# Altium schematic sheet Master.SchDoc
size A4; Author: Jeremiah Lilland; CompanyName: Pinebox Effects; DrawnBy: Jeremiah Lilland; Revision: 1.0
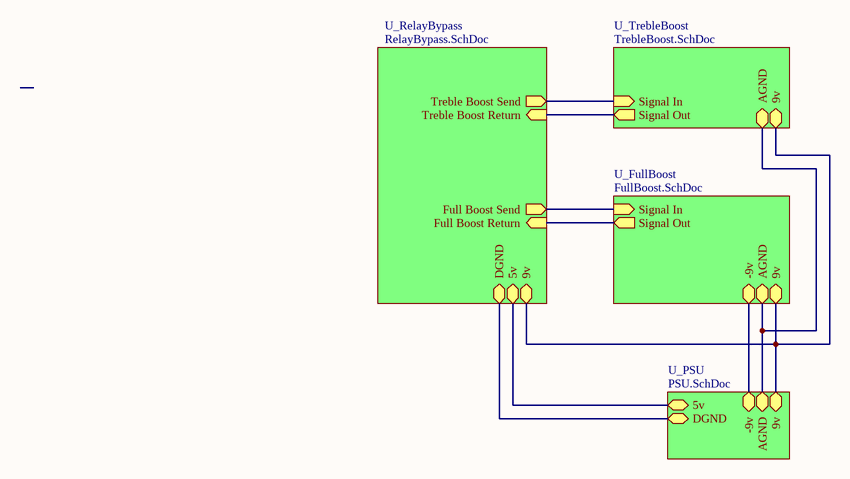
[diagram p0: Master.SchDoc]

## Sub-sheets
U_FullBoost = FullBoost.SchDoc: 9v (bidir), AGND (bidir), -9v (bidir), Signal In (in), Signal Out (out)
U_PSU = PSU.SchDoc: -9v (bidir), DGND (bidir), 5v, AGND, 9v (bidir)
U_RelayBypass = RelayBypass.SchDoc: Treble Boost Send (out), Treble Boost Return (in), Full Boost Send (out), Full Boost Return (in), DGND, 5v, 9v (bidir)
U_TrebleBoost = TrebleBoost.SchDoc: 9v (bidir), AGND (bidir), Signal In (in), Signal Out (out)

## Nets
(unnamed): sheet U_TrebleBoost/9v, sheet U_FullBoost/9v, sheet U_PSU/9v, sheet U_RelayBypass/9v
(unnamed): sheet U_TrebleBoost/AGND, sheet U_FullBoost/AGND, sheet U_PSU/AGND
(unnamed): sheet U_TrebleBoost/Signal In, sheet U_RelayBypass/Treble Boost Send
(unnamed): sheet U_TrebleBoost/Signal Out, sheet U_RelayBypass/Treble Boost Return
(unnamed): sheet U_FullBoost/-9v, sheet U_PSU/-9v
(unnamed): sheet U_FullBoost/Signal In, sheet U_RelayBypass/Full Boost Send
(unnamed): sheet U_FullBoost/Signal Out, sheet U_RelayBypass/Full Boost Return
(unnamed): sheet U_PSU/DGND, sheet U_RelayBypass/DGND
(unnamed): sheet U_PSU/5v, sheet U_RelayBypass/5v

## Notes on the sheet
- Sheet Title:
- Project Title:
- Date:
- Revision:
- Sheet
- of
- File: